# Altium schematic sheet Fuente5VDC.SchDoc
size A4; SheetNumber: 3; SheetTotal: 10
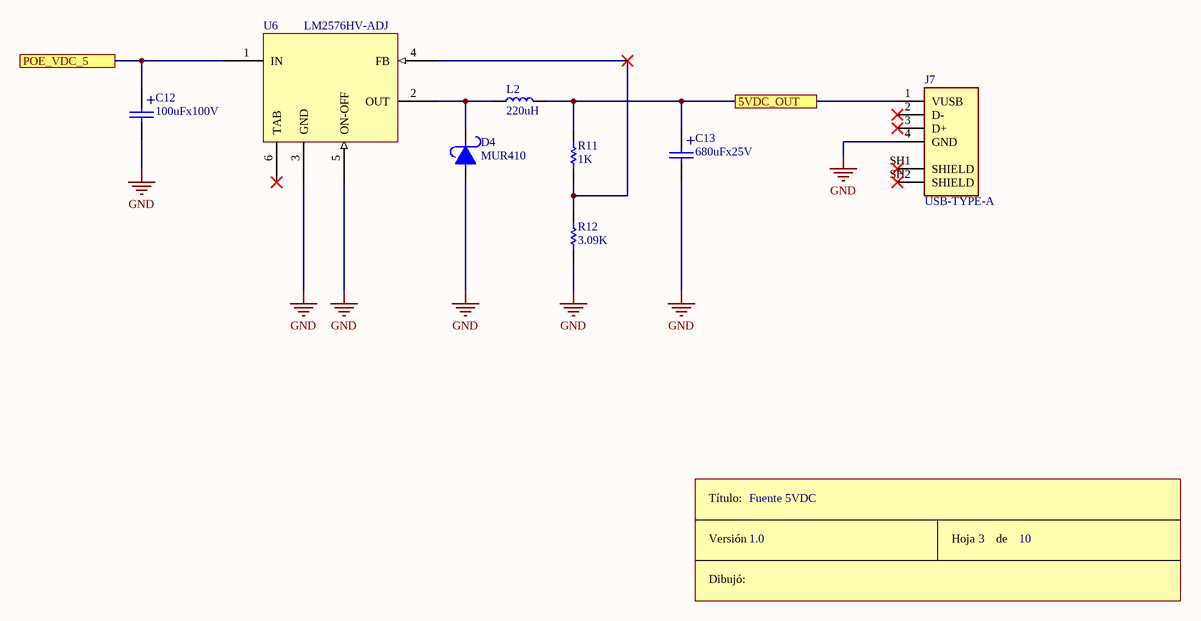
[diagram p0: Fuente5VDC.SchDoc]

## Parts
C12  100uFx100V  [CAP200RP]
C13  680uFx25V  [CAP200RP]
D4  MUR410  [DO41]
J7  USB-TYPE-A  [TE_6364372-2]
L2  220uH  [CHOKE_PAD]
R11  1K  [RES300]
R12  3.09K  [RES300]
ROT5  Rótulo  (value not drawn)  (graphical)
U6  LM2576HV-ADJ  [TO-220_5 H]

## Ports
5VDC_OUT, POE_VDC_5

## Nets
GND: C12.2 C13.2 D4.1 J7.4(GND) R12.1 U6.3(GND) U6.5(ON-OFF)
5VDC_OUT: C13.1 J7.1(VUSB) L2.2 R11.2 ; port 5VDC_OUT
POE_VDC_5: C12.1 U6.1(IN) ; port POE_VDC_5
NetD4_2: D4.2 L2.1 U6.2(OUT)
NetR11_1: R11.1 R12.2 U6.4(FB)

Not connected (* = marked no-connect by the designer): J7 2(D-)* 3(D+)* SH1(SHIELD)* SH2(SHIELD)*; U6 6(TAB)*

## Notes on the sheet
- Fuente 5VDC
- 1.0
- 3
- 10
- (in symbol CAPPOL) +
- (in symbol Rótulo) Título:; Versión; Hoja       de; Dibujó:

## Library data of the parts
C12 C13 = CAPPOL
D4 = DIODO SCHOTTKY
J7 = 6364372-2: Conn USB 2.0 Type A RCP 4 POS Solder RA Thru-Hole 4 Terminal 1 Port Box/Tube; MF: TE Connectivity; Digi-Key_Purchase_URL: https://www.digikey.com/product-detail/en/te-connectivity-amp-connectors/6364372-2/A122647-ND/2286712?utm_source=snapeda&utm_medium=aggregator&utm_campaign=symbol; SnapEDA_Link: https://www.snapeda.com/parts/6364372-2/TE%20Connectivity%20AMP%20Connectors/view-part/2053020/?ref=snap; EU_RoHS_Compliance: Compliant; MP: 6364372-2; Value: *; TE_purchase_URL: https://www.te.com/usa-en/product-6364372-2.html?te_bu=Cor&te_type=disp&te_campaign=seda_glo_cor-seda-global-disp-prtnr-fy19-seda-model-bom-cta_sma-317_1&elqCampaignId=32493; Digi-Key_Part_Number: A122647-ND; Package: None
L2 = Choke
R11 R12 = RES
U6 = LM2575